# Altium schematic sheet AMU-S16-V00-BSPDDelay.SchDoc: RC Charging Delay
size A3; DrawnBy: Jonn Dillon; DocumentNumber: 4; Revision: 01; SheetNumber: 14; SheetTotal: 25
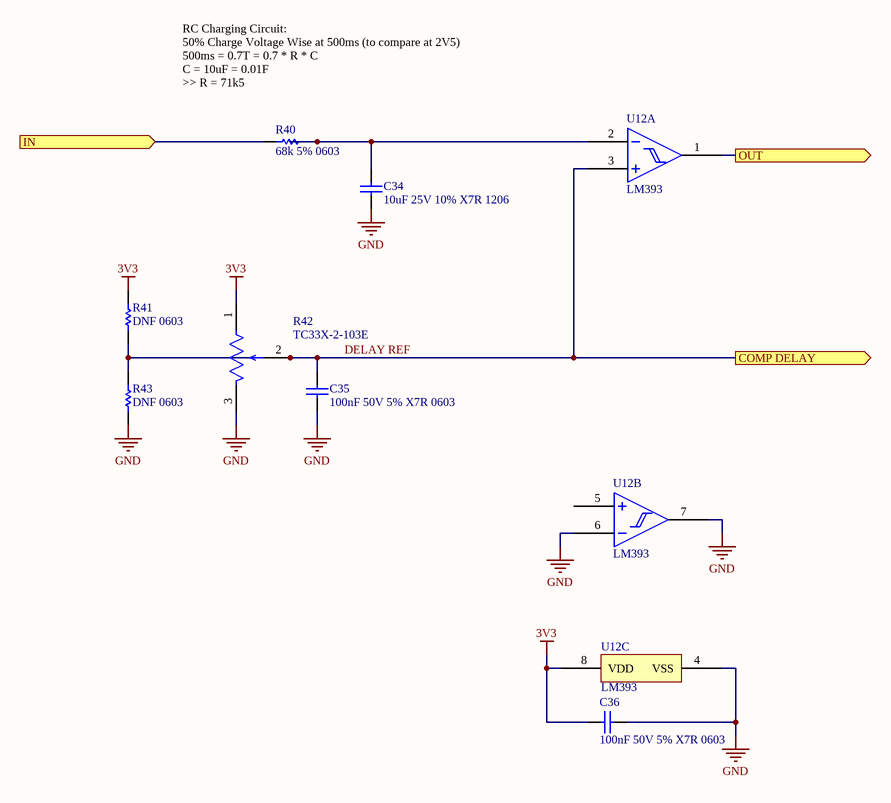
[diagram p0: AMU-S16-V00-BSPDDelay.SchDoc]

## Parts
C34  10uF 25V 10% X7R 1206  [Cap_Ceramic_1206]
C35  100nF 50V 5% X7R 0603  [Cap_Ceramic_0603]
C36  100nF 50V 5% X7R 0603  [Cap_Ceramic_0603]
R40  68k 5% 0603  [Res_ThinFilm_0603]
R41  DNF 0603  [Res_ThinFilm_0603]
R42  TC33X-2-103E  [TC33]
R43  DNF 0603  [Res_ThinFilm_0603]
U12  LM393  [TSSOP-8]  (parts A,B,C of 3)

## Ports
COMP DELAY (out), IN (in), OUT (out)

## Nets
3V3: C36.2 R41.2 R42.1 U12.8(VDD)
GND: C34.1 C35.1 C36.1 R42.3 R43.1 U12.4(VSS) U12.6(IN2-) U12.7(OUT1)
DELAY REF: C35.2 R41.1 R42.2 R43.2 U12.3(IN1+) ; port COMP DELAY
IN: R40.1 ; port IN
OUT: U12.1(OUT1) ; port OUT
NetC34_2: C34.2 R40.2 U12.2(IN1-)

Not connected (* = marked no-connect by the designer): U12 5(IN2+)

## Notes on the sheet
- RC Charging Circuit:
  50% Charge Voltage Wise at 500ms (to compare at 2V5)
  500ms = 0.7T = 0.7 * R * C
  C = 10uF = 0.01F
  >> R = 71k5
- Revision History:
- Sheet Title:
- Rev
- Date
- Description
- Project:
- Size:
- Drawn By:
- A3
- Number:
- Revision:
- Sheet
- Version:
- of
- QUT Motorsport
- O-120, Gardens Point
- 2 George Street
- Brisbane, QLD 4000
- Australia
- Print Date:
- Print Time:
- File Name:

## Library data of the parts
C34 = 10uF 25V 10% X7R 1206: Capacitor, Ceramic, SMD, 10uF, 25V, 10%, X7R, 1206
C35 C36 = 100nF 50V 5% X7R 0603: Capacitor, Ceramic, SMD, 100nF, 50V, 5%, X7R, 0603
R40 = 68k 5% 0603: Resistor, SMD, 68k, 0.1W, 5%, 0603
R41 R43 = DNF 0603: Resistor, SMD, DNF, 0.1W, 0603
R42 = TC33X-2-103E: 10 kOhms 0.1W, 1/10W J Lead Surface Mount Trimmer Potentiometer Cermet 1 Turn Top Adjustment
U12 = LM393: General Purpose Comparitor 2 Circuit 8-SOIC